# Altium schematic sheet TOP.SchDoc
size A3; SheetNumber: 1; SheetTotal: 9
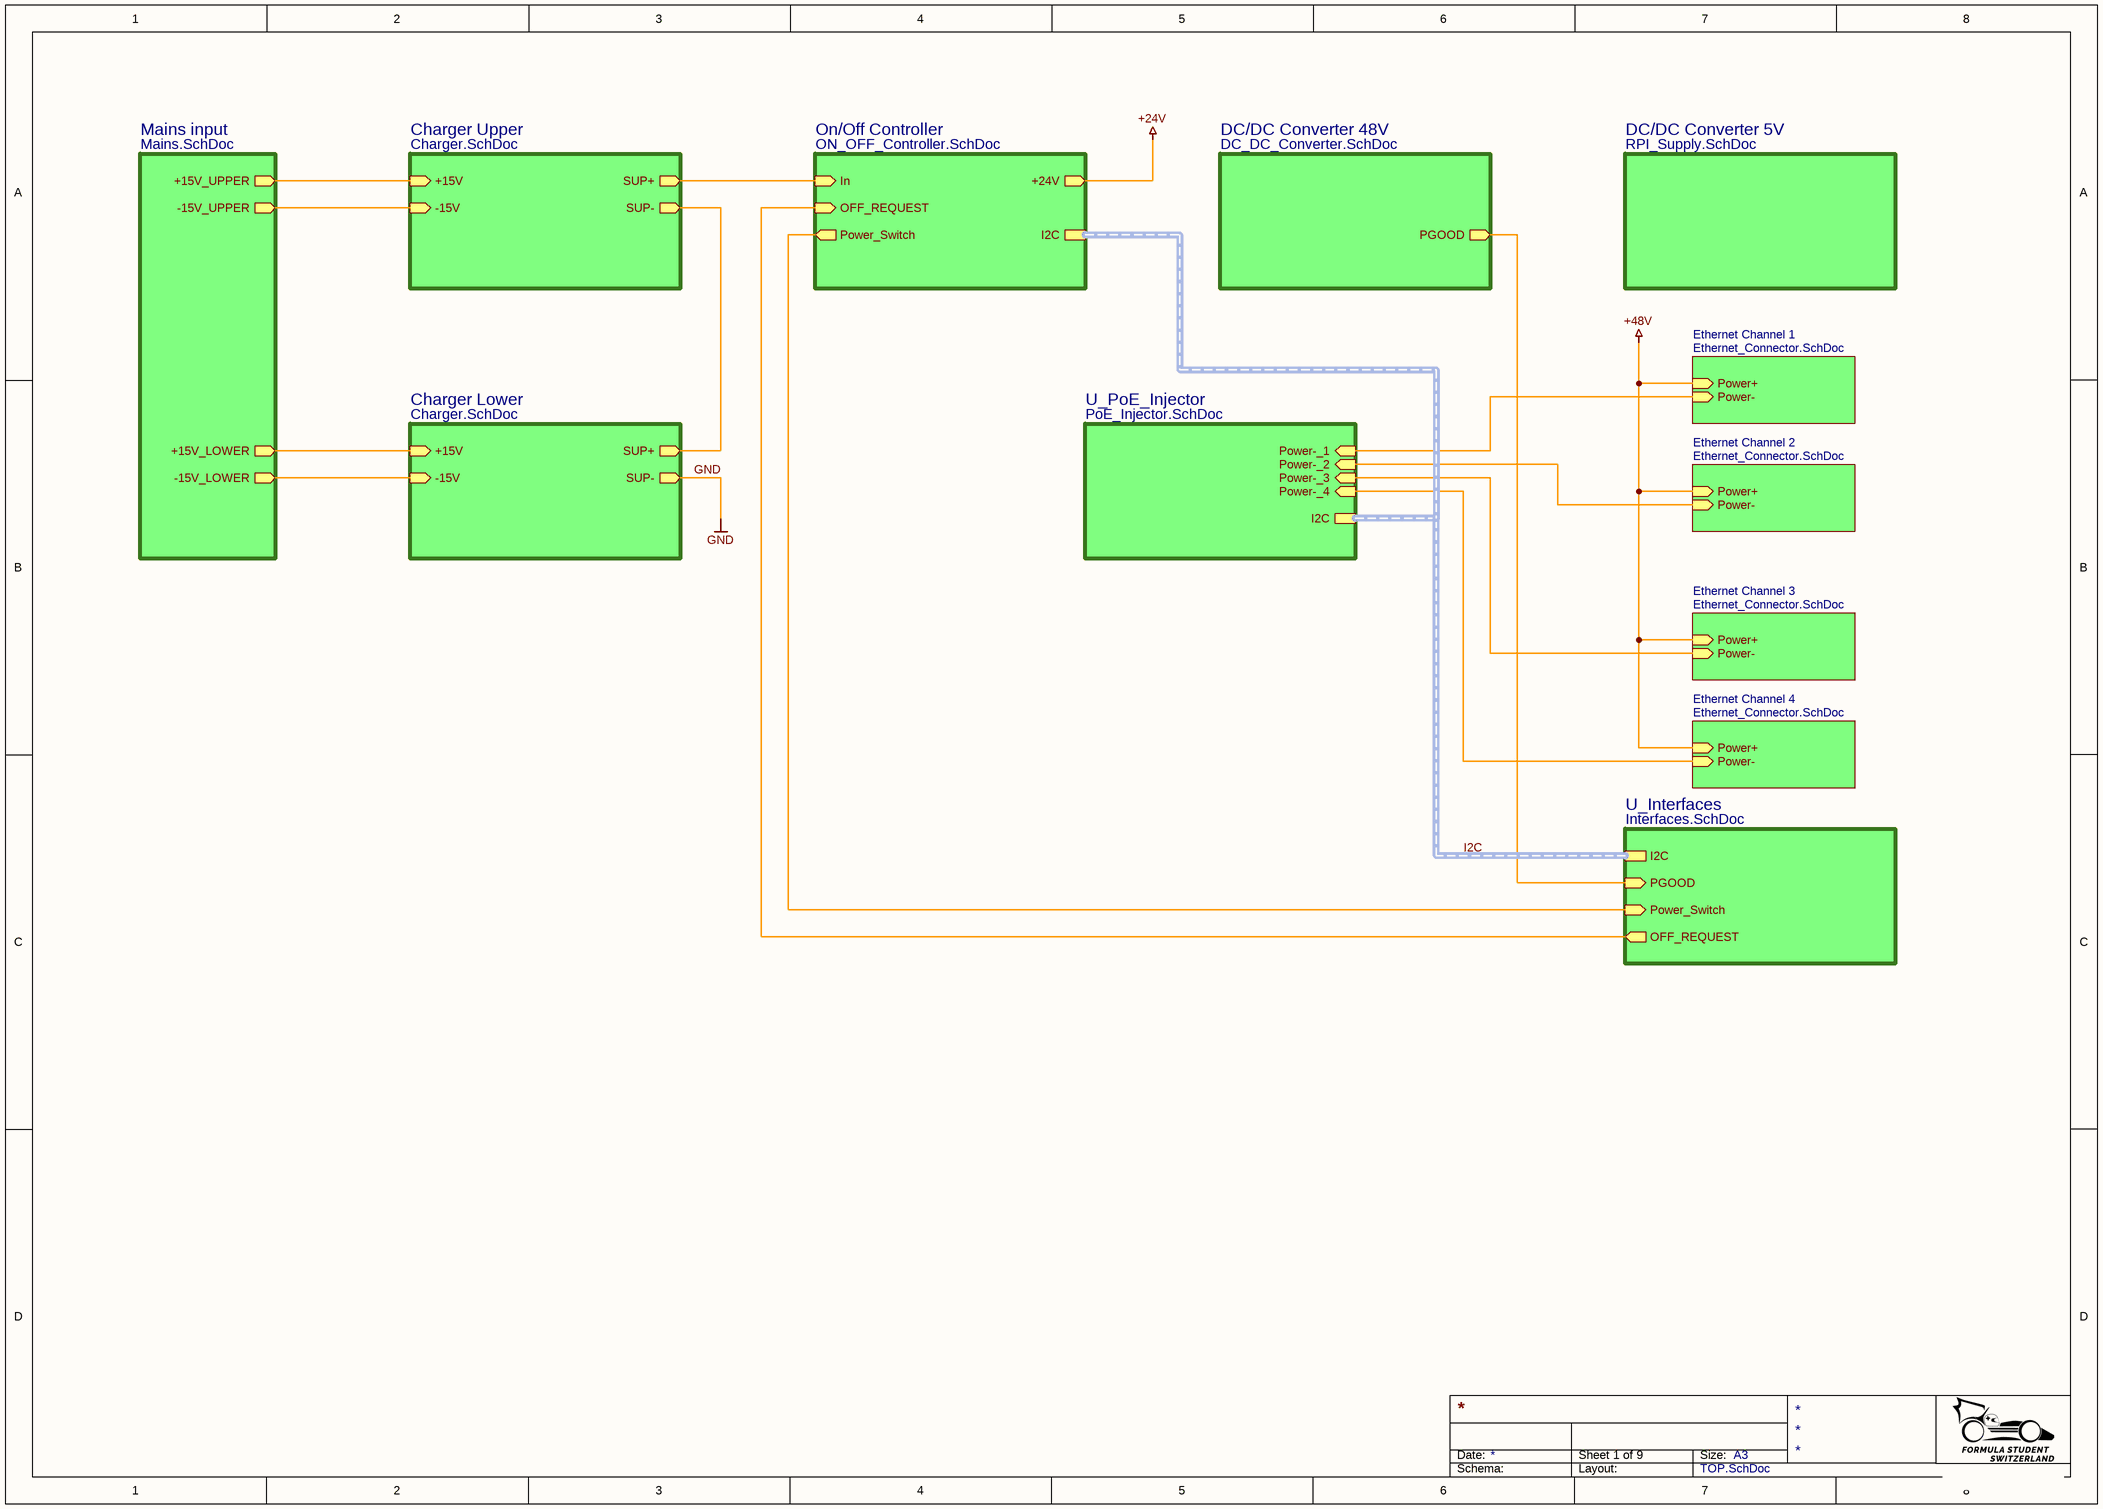
[diagram p0: TOP.SchDoc]

## Sub-sheets
Charger Lower = Charger.SchDoc: +15V (in), -15V (in), SUP+ (out), SUP- (out)
Charger Upper = Charger.SchDoc: +15V (in), -15V (in), SUP+ (out), SUP- (out)
DC/DC Converter 5V = RPI_Supply.SchDoc: no entries
DC/DC Converter 48V = DC_DC_Converter.SchDoc: PGOOD (out)
Ethernet Channel 1 = Ethernet_Connector.SchDoc: Power+ (in), Power- (in)
Ethernet Channel 2 = Ethernet_Connector.SchDoc: Power+ (in), Power- (in)
Ethernet Channel 3 = Ethernet_Connector.SchDoc: Power+ (in), Power- (in)
Ethernet Channel 4 = Ethernet_Connector.SchDoc: Power+ (in), Power- (in)
Mains input = Mains.SchDoc: +15V_UPPER (out), -15V_UPPER (out), +15V_LOWER (out), -15V_LOWER (out)
On/Off Controller = ON_OFF_Controller.SchDoc: In (in), +24V (out), OFF_REQUEST (in), I2C (harness I2C), Power_Switch (out)
U_Interfaces = Interfaces.SchDoc: I2C (harness I2C), OFF_REQUEST (out), Power_Switch (in), PGOOD (in)
U_PoE_Injector = PoE_Injector.SchDoc: Power-_1 (in), Power-_2 (in), Power-_3 (in), Power-_4 (in), I2C (harness I2C)

## Nets
+24V: sheet On/Off Controller/+24V
+48V: sheet Ethernet Channel 1/Power+, sheet Ethernet Channel 2/Power+, sheet Ethernet Channel 3/Power+, sheet Ethernet Channel 4/Power+
GND: sheet Charger Lower/SUP-
(unnamed): sheet Charger Upper/+15V, sheet Mains input/+15V_UPPER
(unnamed): sheet Charger Upper/-15V, sheet Mains input/-15V_UPPER
(unnamed): sheet Charger Upper/SUP+, sheet On/Off Controller/In
(unnamed): sheet Charger Upper/SUP-, sheet Charger Lower/SUP+
(unnamed): sheet Charger Lower/+15V, sheet Mains input/+15V_LOWER
(unnamed): sheet Charger Lower/-15V, sheet Mains input/-15V_LOWER
(unnamed): sheet DC/DC Converter 48V/PGOOD, sheet U_Interfaces/PGOOD
(unnamed): sheet U_PoE_Injector/Power-_1, sheet Ethernet Channel 1/Power-
(unnamed): sheet U_PoE_Injector/Power-_2, sheet Ethernet Channel 2/Power-
(unnamed): sheet U_PoE_Injector/Power-_3, sheet Ethernet Channel 3/Power-
(unnamed): sheet U_PoE_Injector/Power-_4, sheet Ethernet Channel 4/Power-
(unnamed): sheet U_Interfaces/OFF_REQUEST, sheet On/Off Controller/OFF_REQUEST
(unnamed): sheet U_Interfaces/Power_Switch, sheet On/Off Controller/Power_Switch

## Buses and harness runs
harness I2C = sheet On/Off Controller/I2C = sheet U_Interfaces/I2C = sheet U_PoE_Injector/I2C

## Notes on the sheet
- Date:
- Size:
- A3
- Schema:
- Layout: